# Altium project PROC054D_MMW_CAS_RF_EVM.PrjPcb (part 6 of 9)

## Sheet PROC054D_System_3V3_Supply.SchDoc: System_3V3_Supply
size 558 x 431 mm; Date: Not shown in title block; ApprovedBy: Not shown in title block; CheckedBy: Not shown in title block; Author: Not shown in title block; CompanyName: Not shown in title block; DrawnBy: a0271760; Engineer: Not shown in title block; Organization: Not shown in title block; Address1: Not shown in title block; Address2: Not shown in title block; Address3: Not shown in title block; Address4: Not shown in title block; DocumentNumber: 8; Revision: Use project pAWRameter SCH_Rev; SheetNumber: 8; SheetTotal: 19; PageSetup: Record=PageOptions|CenterHorizontal=True|CenterVertical=True|PrintScale=1.00|XCorrection=1.00|YCorrection=1.00|PrintKind=0|BorderSize=5000000|LeftOffset=0|BottomOffset=0|Orientation=2|PaperLength=1000|PaperWidth=1000|Scale=100|PaperSource=15|PrintQuality=600|MediaType=1|DitherType=10|PaperKind=Letter|PrintScaleMode=1; CurrentTime: Not shown in title block; CurrentDate: Not shown in title block; Time: Not shown in title block; DocumentFullPathAndName: Not shown in title block; DocumentName: Not shown in title block; ModifiedDate: Not shown in title block; ImagePath: Not shown in title block
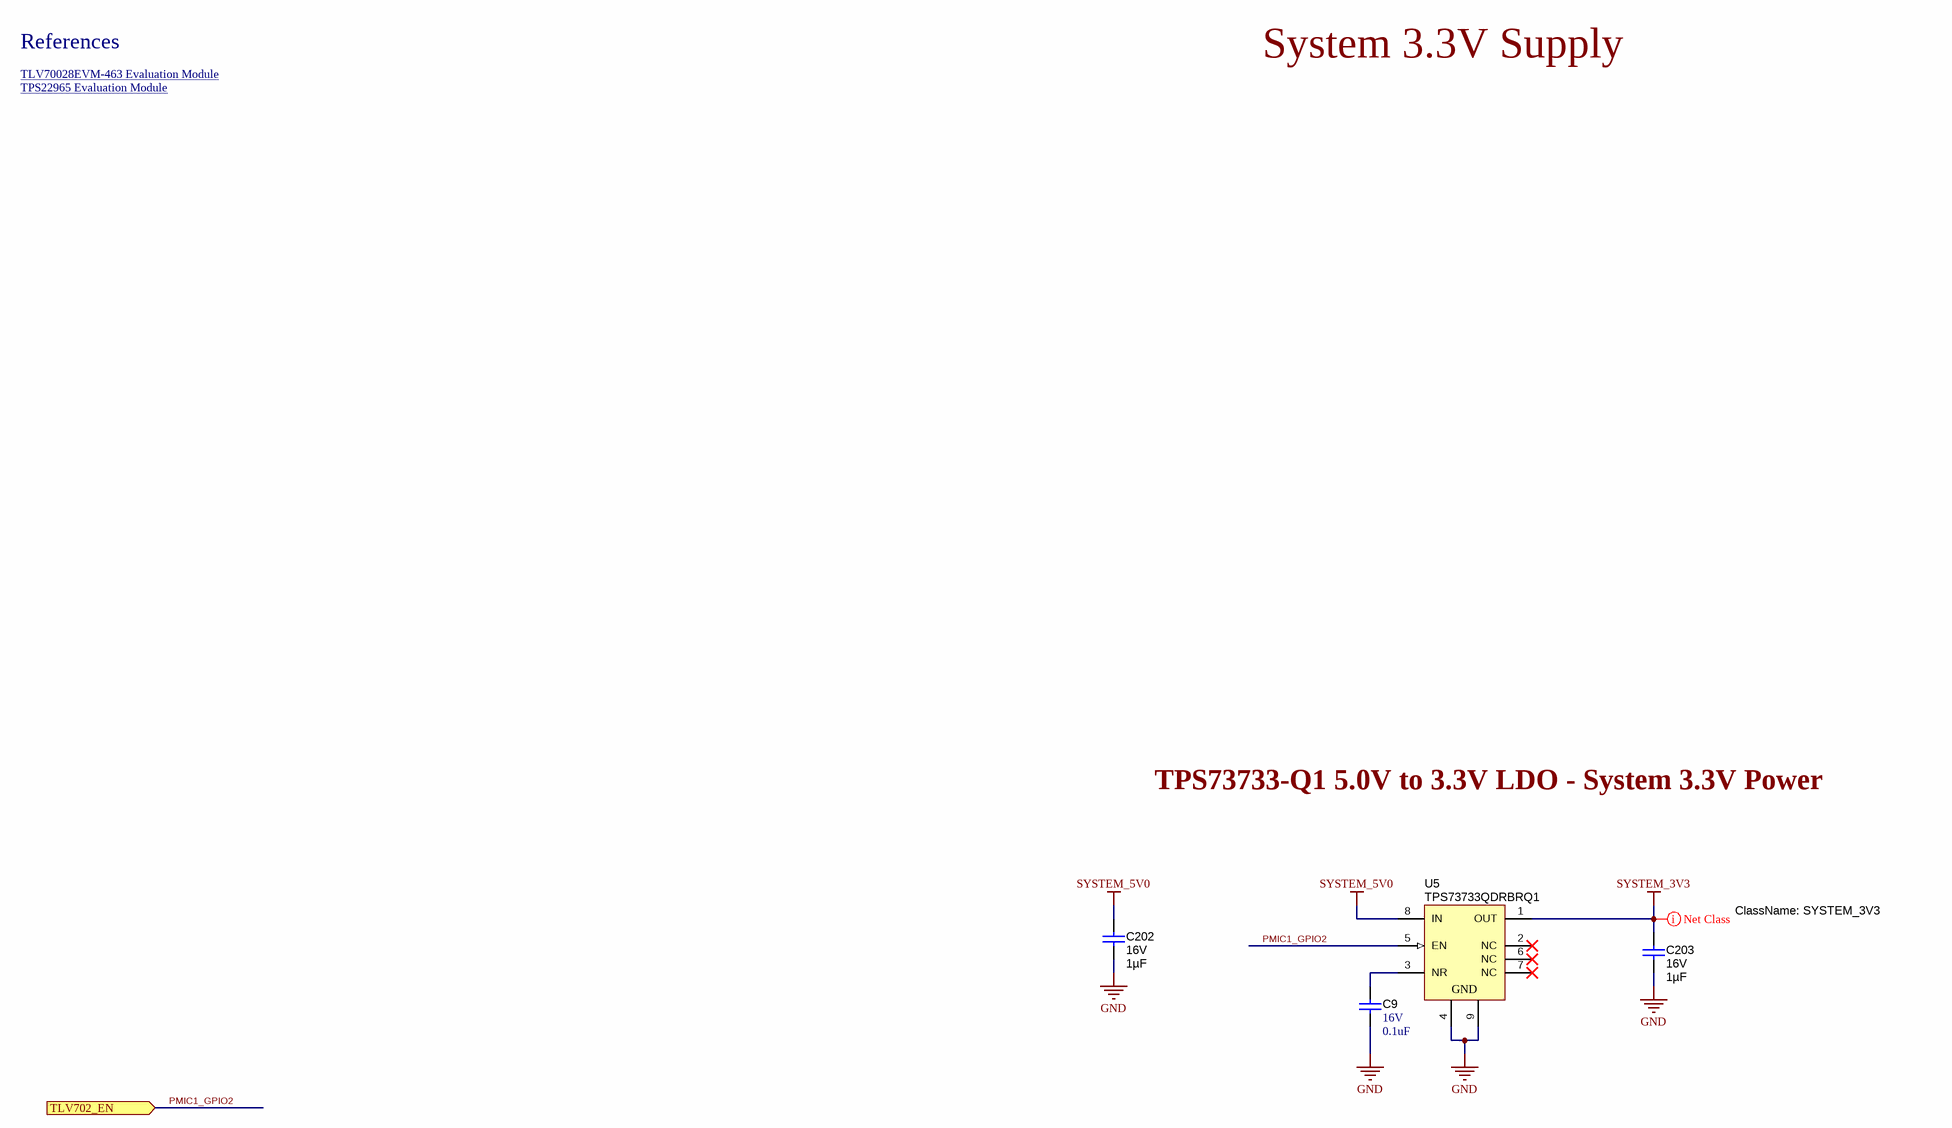
[diagram p27: PROC054D_System_3V3_Supply.SchDoc]

### Parts
C9  VDC_V: 16V  ValueDisplayed: 0.1uF  [0402]  (hidden comment: GCM155R71C104KA55D)
C202  VDC_V: 16V  ValueDisplayed: 1µF  [0603]  (hidden comment: GCM188R71C105KA64J)
C203  VDC_V: 16V  ValueDisplayed: 1µF  [0603]  (hidden comment: GCM188R71C105KA64J)
U5  TPS73733QDRBRQ1  [DRB0008A]

### Ports
TLV702_EN (in)

### Nets
GND: C9.2 C202.2 C203.2 U5.4(GND) U5.9(GND)
SYSTEM_3V3: C203.1 U5.1(OUT)
SYSTEM_5V0: C202.1 U5.8(IN)
PMIC1_GPIO2: U5.5(EN) ; port TLV702_EN
NetC9_1: C9.1 U5.3(NR)

Not connected (* = marked no-connect by the designer): U5 2(NC)* 6(NC)* 7(NC)*

### Layout directives
net class SYSTEM_3V3: SYSTEM_3V3

### Notes on the sheet
- References
- System 3.3V Supply
- TLV70028EVM-463 Evaluation Module <http://www.ti.com/tool/tlv70028evm-463>
- TPS22965 Evaluation Module <http://www.ti.com/tool/tps22965evm-023>
- TPS73733-Q1 5.0V to 3.3V LDO - System 3.3V Power
- Drawn By:
- SVN Rev:
- Number:
- TID #:
- Orderable:
- Rev:
- Sheet Title:
- File:
- Project Title:
- Designed for:
- Assembly VAWRiant:
- Mod. Date:
- Sheet:
- Size:
- of
- C
- http://www.ti.com
- Texas Instruments and/or its licensors do not wAWRrant the accuracy or completeness of this specification or any information contained therein. Texas Instruments and/or its licensors do not wAWRrant that this design will meet the specifications, will be suitable for your application or fit for any pAWRticulAWR purpose, or will operate in an implementation. Texas Instruments and/or its licensors do not wAWRrant that the design is production worthy. You should completely validate and test your design implementation to confirm the system functionality for your application.
- Engineer:
- Contact:
- © Texas Instruments

### Library data of the parts
C9 = CMP-0006351-2: as C162 on sheet PROC054D_System_Power; Publisher: Texas Instruments; TempCo: X7R; Published: 2008-06-19; RoHS: Y; MountType: SMT; Supplier 1: Digi-Key; PackageReference: 0402; Tolerance_%: 10%; Cap_Case: 0402; Value2: 16V; SizeArea_mm2: 0.5; CompType: Capacitor; LatestRevisionDate: 2017-03-09; PartNumber: GCM155R71C104KA55D; AEC Qualified: ?; ComponentLink1Description: Datasheet link; Supplier Part Number 1: 490-4759-2-ND; Technology: Ceramic; ComponentLink1URL: http://psearch.murata.com/capacitor/product/GCM155R71C104KA55%23.pdf
C202 C203 = CMP-0079154-1: CAP, CERM, 1 µF, 16 V,+/- 10%, X7R, AEC-Q200 Grade 1, 0603; Manufacturer: MuRata; SizeAreaWB_mm2: 4.68; SizeArea_mm2: 1.28; AEC Qualified: Y; AEC Category: Q200; Value: 1uF; TaMax_C: 125°C; SizeZ_mm: 1; Polarized: N; TaMin_C: -55°C; SizeY_mm: 0.8; U/M: EA; SizeX_mm: 1.6; ComponentLink1Description: Datasheet link; Cap_F: 1µF; RoHS: Y; Tolerance_%: 10%; Supplier 1: Digi-Key; PackageReference: 0603; Technology: Ceramic; PartNumber: GCM188R71C105KA64J; TempCo: X7R; Supplier Part Number 2: 81-GCM188R71C105KA4J; Supplier 2: Mouser; AEC Grade: 1; Value2: 16V; ComponentLink1URL: https://www.murata.com/~/media/webrenewal/support/library/catalog/products/capacitor/mlcc/c03e.ashx; CompType: Capacitor; MountType: SMT; Supplier Part Number 1: 490-12657-1-ND; Cap_Case: 0603
U5 = CMP-0036354-2: Single Output Automotive LDO, 1 A, Fixed 3.3 V Output, 2.2 to 5.5 V Input, with Reverse Current Protection, 8-pin SON (DRB), -40 to 125 degC, Green (RoHS & no Sb/Br); Manufacturer: Texas Instruments; Vin(Min)(V): 2.2; Vout Adj(Max)(V): 3.3; Vin(Max)(V): 5.5; Accuracy(%): 3; SubFamily: Single Channel LDO; Iq(Typ)(mA): 0.3; Vdo(Typ)(mV): 130; Iout(Max)(A): 1; ComponentLink1URL: http://www.ti.com/; Fixed Output Options(V): 3.3; PackageDescription: 8-Pin Plastic Small Outline, Body 3 x 3 mm, Pitch 0.65 mm; ComponentLink2URL: http://www.ti.com/general/docs/lit/getliterature.tsp?genericPartNumber=TPS73733-Q1&fileType=pdf; ComponentLink3Description: Package Specification; Eco-Plan: Green (RoHS & no Sb/Br); ComponentLink2Description: Datasheet; Vout Adj(Min)(V): 3.3; Rating: Automotive; ComponentLink3URL: http://www.ti.com/litv/pdf/mpds118h; PackageReference: DRB0008A; DatasheetVersion: SBVS123; PartNumber: TPS73733QDRBRQ1; PackageVersion: 4203482-2/K; Mounting Technology: Surface Mount; ComponentLink1Description: Manufacturer URL

## Sheet PROC054D_AWR_2_AWR_3_LP87524P.SchDoc: AWR_2_AWR_3_LP87524P
size 558 x 431 mm; Date: Not shown in title block; ApprovedBy: Not shown in title block; CheckedBy: Not shown in title block; Author: Not shown in title block; CompanyName: Not shown in title block; DrawnBy: a0271760; Engineer: Not shown in title block; Organization: Not shown in title block; Address1: Not shown in title block; Address2: Not shown in title block; Address3: Not shown in title block; Address4: Not shown in title block; DocumentNumber: 5; Revision: Use project pAWRameter SCH_Rev; SheetNumber: 5; SheetTotal: 19; PageSetup: Record=PageOptions|CenterHorizontal=True|CenterVertical=True|PrintScale=1.00|XCorrection=1.00|YCorrection=1.00|PrintKind=0|BorderSize=5000000|LeftOffset=0|BottomOffset=0|Orientation=2|PaperLength=1000|PaperWidth=1000|Scale=100|PaperSource=15|PrintQuality=600|MediaType=1|DitherType=10|PaperKind=Letter|PrintScaleMode=1; CurrentTime: Not shown in title block; CurrentDate: Not shown in title block; Time: Not shown in title block; DocumentFullPathAndName: Not shown in title block; DocumentName: Not shown in title block; ModifiedDate: Not shown in title block; ImagePath: Not shown in title block
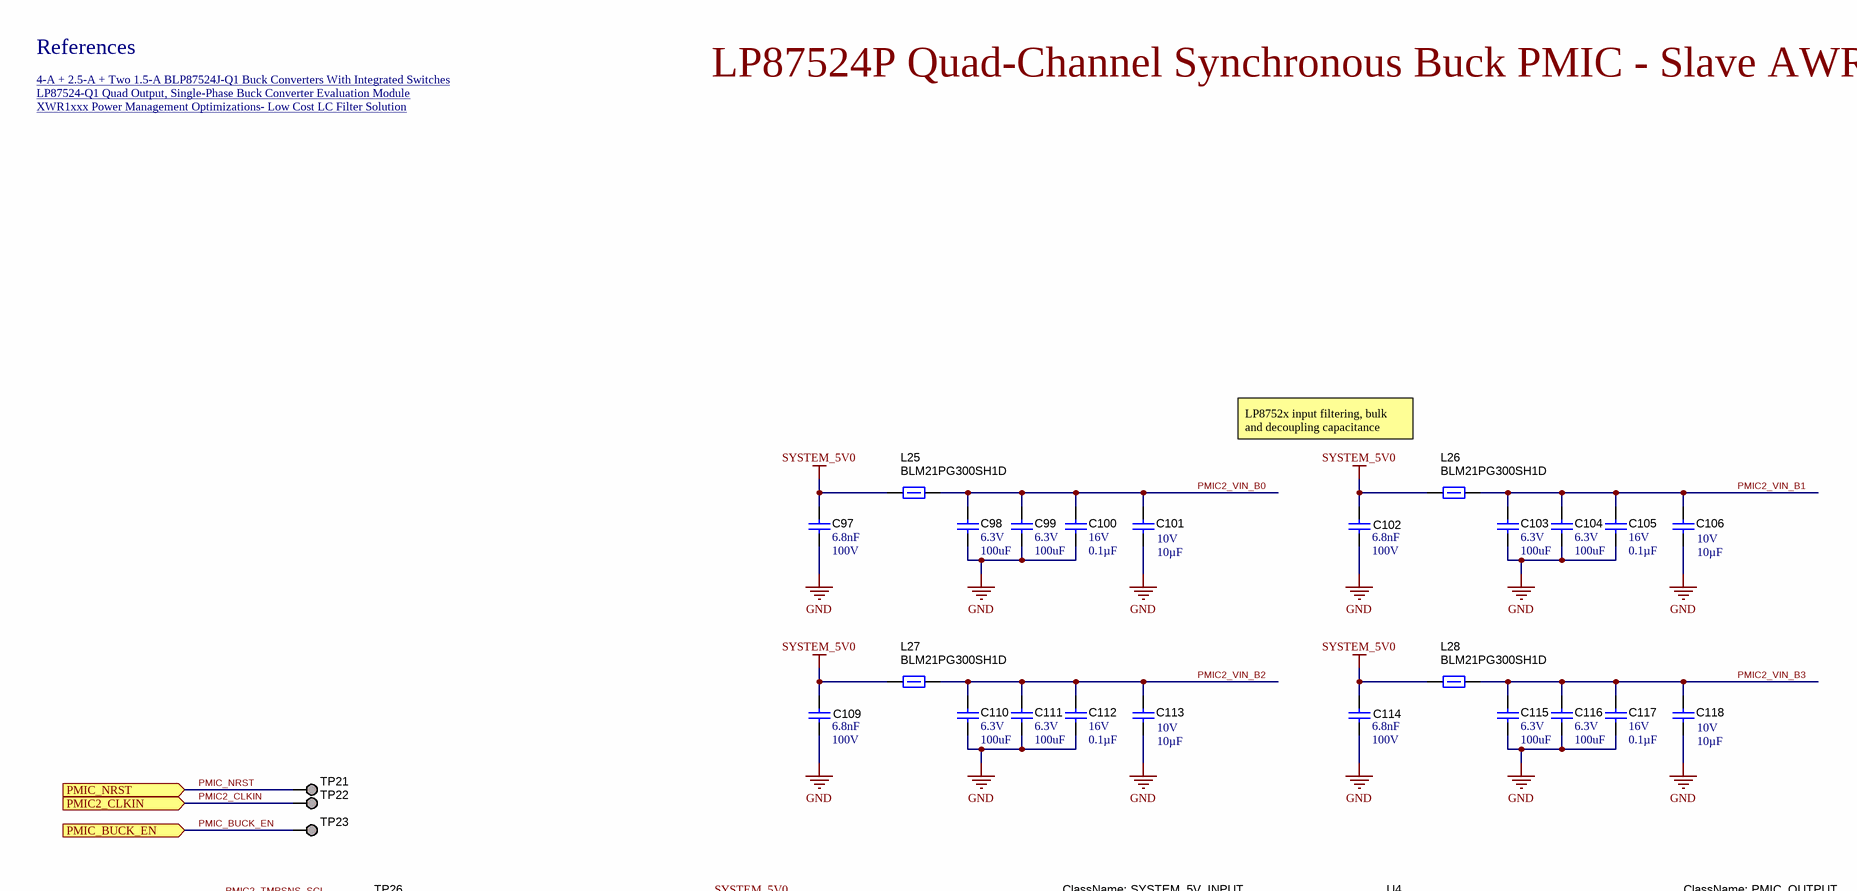
[diagram p28: PROC054D_AWR_2_AWR_3_LP87524P.SchDoc, top left]
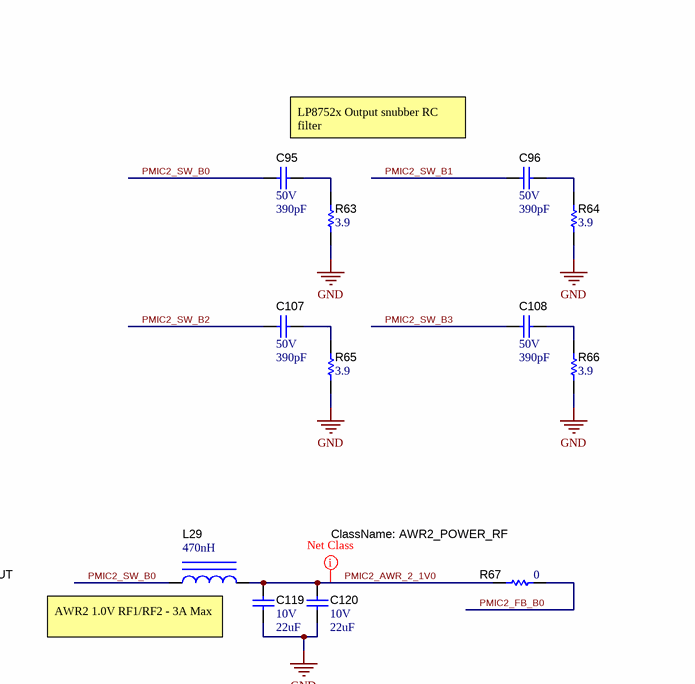
[diagram p29: PROC054D_AWR_2_AWR_3_LP87524P.SchDoc, top right]
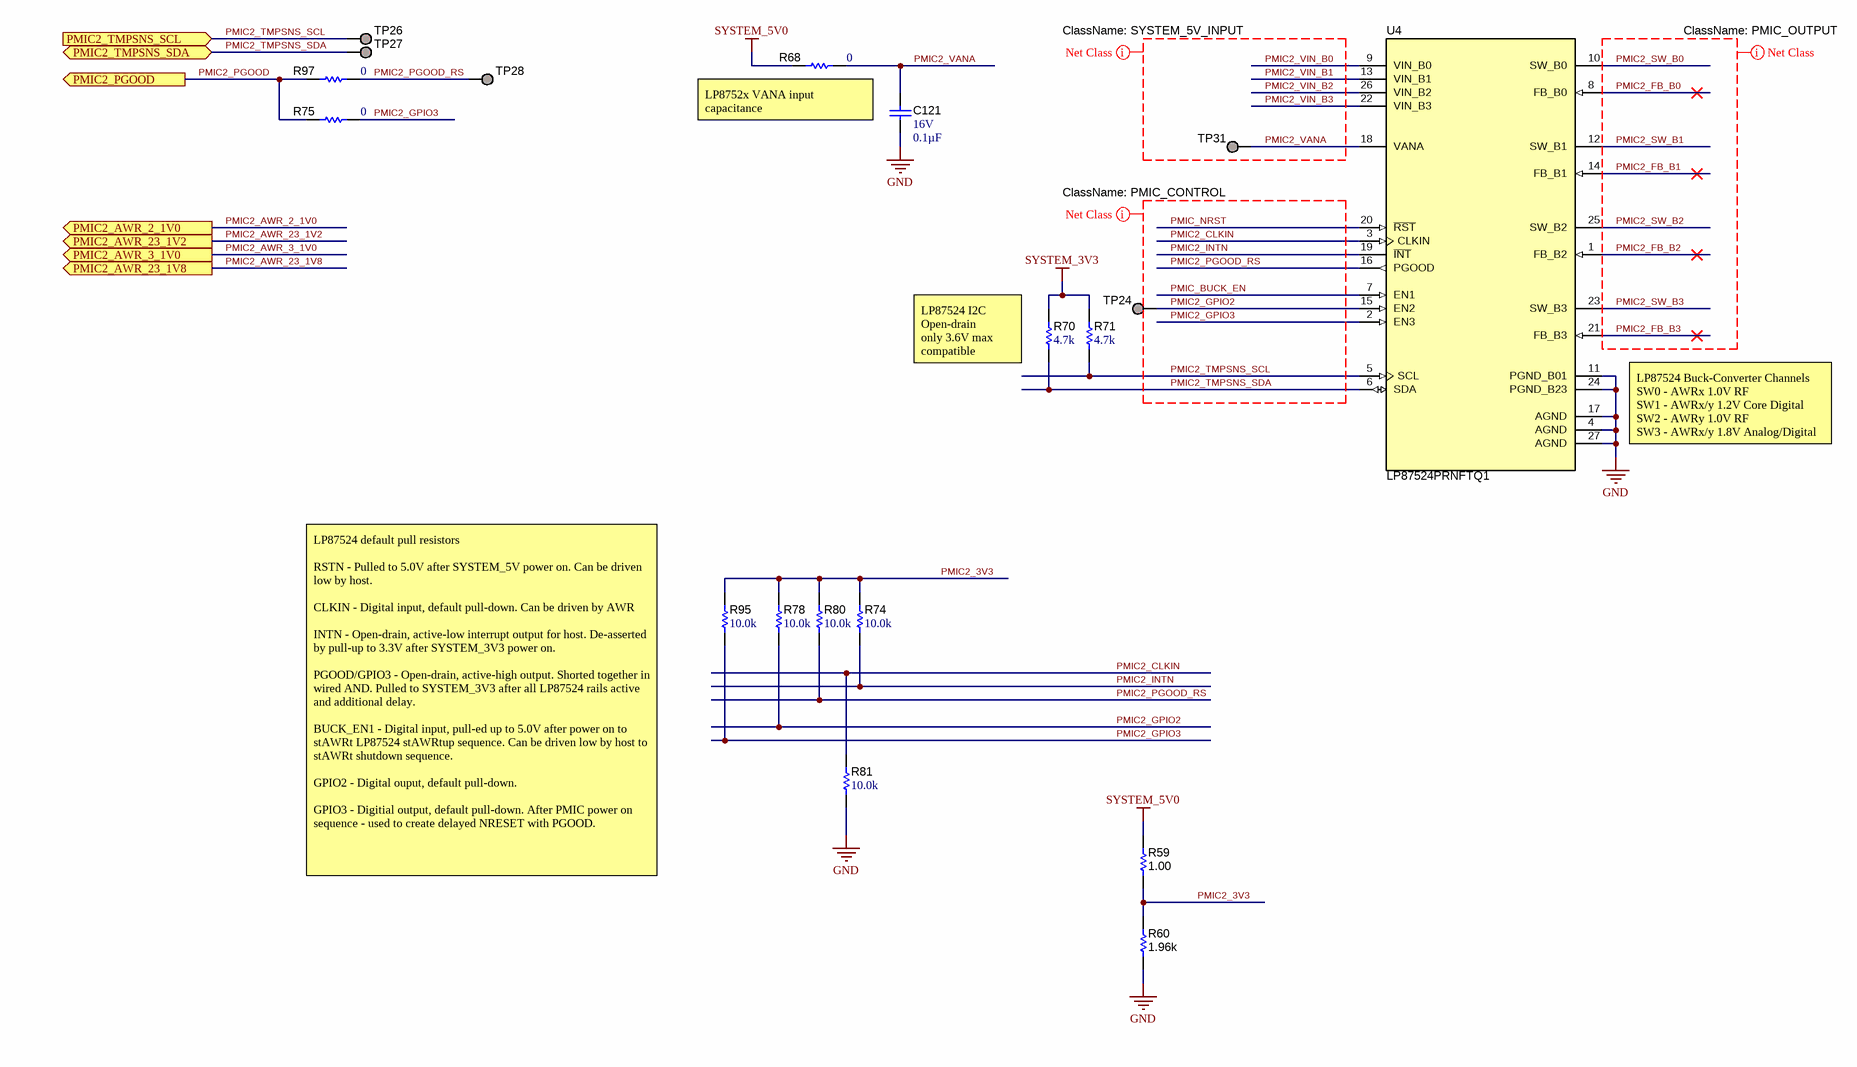
[diagram p30: PROC054D_AWR_2_AWR_3_LP87524P.SchDoc, bottom left]
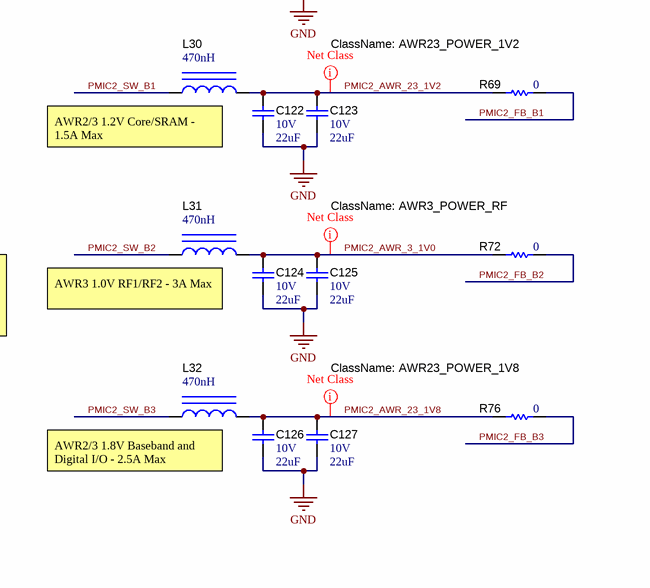
[diagram p31: PROC054D_AWR_2_AWR_3_LP87524P.SchDoc, bottom right]

### Parts
C95  VDC_V: 50V  ValueDisplayed: 390pF  [0402S]  (hidden comment: GCM155R71H391KA37D)
C96  VDC_V: 50V  ValueDisplayed: 390pF  [0402S]  (hidden comment: GCM155R71H391KA37D)
C97  Cap_F: 6.8nF  VDC_V: 100V  [0603S]  (hidden comment: GCM188R72A682KA37D)
C98  VDC_V: 6.3V  ValueDisplayed: 100uF  [0805L]  (hidden comment: GRM21BR60J107M)
C99  VDC_V: 6.3V  ValueDisplayed: 100uF  [0805L]  (hidden comment: GRM21BR60J107M)
C100  VDC_V: 16V  ValueDisplayed: 0.1µF  [0402S]  (hidden comment: GCM155R71C104JA55D)
C101  Cap_F: 10µF  VDC_V: 10V  [0805L]  (hidden comment: GRM21BR71A106KA73L)
C102  Cap_F: 6.8nF  VDC_V: 100V  [0603S]  (hidden comment: GCM188R72A682KA37D)
C103  VDC_V: 6.3V  ValueDisplayed: 100uF  [0805L]  (hidden comment: GRM21BR60J107M)
C104  VDC_V: 6.3V  ValueDisplayed: 100uF  [0805L]  (hidden comment: GRM21BR60J107M)
C105  VDC_V: 16V  ValueDisplayed: 0.1µF  [0402S]  (hidden comment: GCM155R71C104JA55D)
C106  Cap_F: 10µF  VDC_V: 10V  [0805L]  (hidden comment: GRM21BR71A106KA73L)
C107  VDC_V: 50V  ValueDisplayed: 390pF  [0402S]  (hidden comment: GCM155R71H391KA37D)
C108  VDC_V: 50V  ValueDisplayed: 390pF  [0402S]  (hidden comment: GCM155R71H391KA37D)
C109  Cap_F: 6.8nF  VDC_V: 100V  [0603S]  (hidden comment: GCM188R72A682KA37D)
C110  VDC_V: 6.3V  ValueDisplayed: 100uF  [0805L]  (hidden comment: GRM21BR60J107M)
C111  VDC_V: 6.3V  ValueDisplayed: 100uF  [0805L]  (hidden comment: GRM21BR60J107M)
C112  VDC_V: 16V  ValueDisplayed: 0.1µF  [0402S]  (hidden comment: GCM155R71C104JA55D)
C113  Cap_F: 10µF  VDC_V: 10V  [0805L]  (hidden comment: GRM21BR71A106KA73L)
C114  Cap_F: 6.8nF  VDC_V: 100V  [0603S]  (hidden comment: GCM188R72A682KA37D)
C115  VDC_V: 6.3V  ValueDisplayed: 100uF  [0805L]  (hidden comment: GRM21BR60J107M)
C116  VDC_V: 6.3V  ValueDisplayed: 100uF  [0805L]  (hidden comment: GRM21BR60J107M)
C117  VDC_V: 16V  ValueDisplayed: 0.1µF  [0402S]  (hidden comment: GCM155R71C104JA55D)
C118  Cap_F: 10µF  VDC_V: 10V  [0805L]  (hidden comment: GRM21BR71A106KA73L)
C119  VDC_V: 10V  ValueDisplayed: 22uF  [0805L]  (hidden comment: C2012X7S1A226M125AC)
C120  VDC_V: 10V  ValueDisplayed: 22uF  [0805L]  (hidden comment: C2012X7S1A226M125AC)
C121  VDC_V: 16V  ValueDisplayed: 0.1µF  [0402S]  (hidden comment: GCM155R71C104JA55D)
C122  VDC_V: 10V  ValueDisplayed: 22uF  [0805L]  (hidden comment: C2012X7S1A226M125AC)
C123  VDC_V: 10V  ValueDisplayed: 22uF  [0805L]  (hidden comment: C2012X7S1A226M125AC)
C124  VDC_V: 10V  ValueDisplayed: 22uF  [0805L]  (hidden comment: C2012X7S1A226M125AC)
C125  VDC_V: 10V  ValueDisplayed: 22uF  [0805L]  (hidden comment: C2012X7S1A226M125AC)
C126  VDC_V: 10V  ValueDisplayed: 22uF  [0805L]  (hidden comment: C2012X7S1A226M125AC)
C127  VDC_V: 10V  ValueDisplayed: 22uF  [0805L]  (hidden comment: C2012X7S1A226M125AC)
L25  BLM21PG300SH1D  [0805_HV]
L26  BLM21PG300SH1D  [0805_HV]
L27  BLM21PG300SH1D  [0805_HV]
L28  BLM21PG300SH1D  [0805_HV]
L29  ValueDisplayed: 470nH  [DFE252012P]  (hidden comment: DFE252012PD-R47M)
L30  ValueDisplayed: 470nH  [DFE252012P]  (hidden comment: DFE252012PD-R47M)
L31  ValueDisplayed: 470nH  [DFE252012P]  (hidden comment: DFE252012PD-R47M)
L32  ValueDisplayed: 470nH  [DFE252012P]  (hidden comment: DFE252012PD-R47M)
R59  ValueDisplayed: 1.00  [0603]  (hidden comment: CRCW06031R00FKEA)
R60  ValueDisplayed: 1.96k  [0603]  (hidden comment: CRCW06031K96FKEA)
R63  ValueDisplayed: 3.9  [0402S]  (hidden comment: CRCW04023R90JNED)
R64  ValueDisplayed: 3.9  [0402S]  (hidden comment: CRCW04023R90JNED)
R65  ValueDisplayed: 3.9  [0402S]  (hidden comment: CRCW04023R90JNED)
R66  ValueDisplayed: 3.9  [0402S]  (hidden comment: CRCW04023R90JNED)
R67  ValueDisplayed: 0  [0402S]  (hidden comment: CRCW04020000Z0ED)
R68  ValueDisplayed: 0  [0603S]  (hidden comment: MCT06030Z0000ZP500)
R69  ValueDisplayed: 0  [0402S]  (hidden comment: CRCW04020000Z0ED)
R70  ValueDisplayed: 4.7k  [0402]  (hidden comment: CRCW04024K70JNED)
R71  ValueDisplayed: 4.7k  [0402]  (hidden comment: CRCW04024K70JNED)
R72  ValueDisplayed: 0  [0402S]  (hidden comment: CRCW04020000Z0ED)
R74  ValueDisplayed: 10.0k  [0402]  (hidden comment: CRCW040210K0FKED)
R75  ValueDisplayed: 0  [0603]  (hidden comment: MCT06030Z0000ZP500)
R76  ValueDisplayed: 0  [0402S]  (hidden comment: CRCW04020000Z0ED)
R78  ValueDisplayed: 10.0k  [0402S]  (hidden comment: CRCW040210K0FKED)
R80  ValueDisplayed: 10.0k  [0402]  (hidden comment: CRCW040210K0FKED)
R81  ValueDisplayed: 10.0k  [0402]  (hidden comment: CRCW040210K0FKED)
R95  ValueDisplayed: 10.0k  [0402]  (hidden comment: CRCW040210K0FKED)
R97  ValueDisplayed: 0  [0603]  (hidden comment: MCT06030Z0000ZP500)
TP21  TP_SM_1MM  [TP_SM_1MM]  (value not drawn)  (no BOM)
TP22  TP_SM_1MM  [TP_SM_1MM]  (value not drawn)  (no BOM)
TP23  TP_SM_1MM  [TP_SM_1MM]  (value not drawn)  (no BOM)
TP24  TP_SM_1MM  [TP_SM_1MM]  (value not drawn)  (no BOM)
TP26  TP_SM_1MM  [TP_SM_1MM]  (value not drawn)  (no BOM)
TP27  TP_SM_1MM  [TP_SM_1MM]  (value not drawn)  (no BOM)
TP28  TP_SM_1MM  [TP_SM_1MM]  (value not drawn)  (no BOM)
TP31  TP_SM_1MM  [TP_SM_1MM]  (value not drawn)  (no BOM)
U4  LP87524PRNFTQ1  [RNF0026C]

### Ports
PMIC2_AWR_2_1V0 (out), PMIC2_AWR_3_1V0 (out), PMIC2_AWR_23_1V2 (out), PMIC2_AWR_23_1V8 (out), PMIC2_CLKIN (in), PMIC2_PGOOD (out), PMIC2_TMPSNS_SCL (in), PMIC2_TMPSNS_SDA (bidir), PMIC_BUCK_EN (in), PMIC_NRST (in)

### Nets
GND: C97.2 C98.2 C99.2 C100.2 C101.2 C102.2 C103.2 C104.2 C105.2 C106.2 C109.2 C110.2 C111.2 C112.2 C113.2 C114.2 C115.2 C116.2 C117.2 C118.2 C119.2 C120.2 C121.2 C122.2 C123.2 C124.2 C125.2 C126.2 C127.2 R60.1 R63.1 R64.1 R65.1 R66.1 R81.1 U4.4(AGND) U4.11(PGND_B01) U4.17(AGND) U4.24(PGND_B23) U4.27(AGND)
SYSTEM_3V3: R70.1 R71.2
SYSTEM_5V0: C97.1 C102.1 C109.1 C114.1 L25.1 L26.1 L27.1 L28.1 R59.2 R68.1
PMIC2_3V3: R59.1 R60.2 R74.2 R78.2 R80.2 R95.2
PMIC2_AWR_2_1V0: C119.1 C120.1 L29.2 R67.1 ; port PMIC2_AWR_2_1V0
PMIC2_AWR_3_1V0: C124.1 C125.1 L31.2 R72.1 ; port PMIC2_AWR_3_1V0
PMIC2_AWR_23_1V2: C122.1 C123.1 L30.2 R69.1 ; port PMIC2_AWR_23_1V2
PMIC2_AWR_23_1V8: C126.1 C127.1 L32.2 R76.1 ; port PMIC2_AWR_23_1V8
PMIC2_CLKIN: R81.2 TP22.1 U4.3(CLKIN) ; port PMIC2_CLKIN
PMIC2_FB_B0: R67.2 U4.8(FB_B0)
PMIC2_FB_B1: R69.2 U4.14(FB_B1)
PMIC2_FB_B2: R72.2 U4.1(FB_B2)
PMIC2_FB_B3: R76.2 U4.21(FB_B3)
PMIC2_GPIO2: R78.1 TP24.1 U4.15(EN2)
PMIC2_GPIO3: R75.2 R95.1 U4.2(EN3)
PMIC2_INTN: R74.1 U4.19(~{INT})
PMIC2_PGOOD: R75.1 R97.1 ; port PMIC2_PGOOD
PMIC2_PGOOD_RS: R80.1 R97.2 TP28.1 U4.16(PGOOD)
PMIC2_SW_B0: C95.1 L29.1 U4.10(SW_B0)
PMIC2_SW_B1: C96.1 L30.1 U4.12(SW_B1)
PMIC2_SW_B2: C107.1 L31.1 U4.25(SW_B2)
PMIC2_SW_B3: C108.1 L32.1 U4.23(SW_B3)
PMIC2_TMPSNS_SCL: R71.1 TP26.1 U4.5(SCL) ; port PMIC2_TMPSNS_SCL
PMIC2_TMPSNS_SDA: R70.2 TP27.1 U4.6(SDA) ; port PMIC2_TMPSNS_SDA
PMIC2_VANA: C121.1 R68.2 TP31.1 U4.18(VANA)
PMIC2_VIN_B0: C98.1 C99.1 C100.1 C101.1 L25.2 U4.9(VIN_B0)
PMIC2_VIN_B1: C103.1 C104.1 C105.1 C106.1 L26.2 U4.13(VIN_B1)
PMIC2_VIN_B2: C110.1 C111.1 C112.1 C113.1 L27.2 U4.26(VIN_B2)
PMIC2_VIN_B3: C115.1 C116.1 C117.1 C118.1 L28.2 U4.22(VIN_B3)
PMIC_BUCK_EN: TP23.1 U4.7(EN1) ; port PMIC_BUCK_EN
PMIC_NRST: TP21.1 U4.20(~{RST}) ; port PMIC_NRST
NetC95_2: C95.2 R63.2
NetC96_2: C96.2 R64.2
NetC107_2: C107.2 R65.2
NetC108_2: C108.2 R66.2

### Layout directives
net class SYSTEM_5V_INPUT: PMIC2_VANA, PMIC2_VIN_B0, PMIC2_VIN_B1, PMIC2_VIN_B2, PMIC2_VIN_B3
net class PMIC_CONTROL: PMIC2_CLKIN, PMIC2_GPIO2, PMIC2_GPIO3, PMIC2_INTN, PMIC2_PGOOD_RS, PMIC2_TMPSNS_SCL, PMIC2_TMPSNS_SDA, PMIC_BUCK_EN, PMIC_NRST
net class PMIC_OUTPUT: PMIC2_FB_B0, PMIC2_FB_B1, PMIC2_FB_B2, PMIC2_FB_B3, PMIC2_SW_B0, PMIC2_SW_B1, PMIC2_SW_B2, PMIC2_SW_B3
net class AWR23_POWER_1V2: PMIC2_AWR_23_1V2
net class AWR23_POWER_1V8: PMIC2_AWR_23_1V8
net class AWR2_POWER_RF: PMIC2_AWR_2_1V0
net class AWR3_POWER_RF: PMIC2_AWR_3_1V0

### Notes on the sheet
- References
- LP87524-Q1 Quad Output, Single-Phase Buck Converter Evaluation Module <http://www.ti.com/tool/lp87524q1evm>
- 4-A + 2.5-A + Two 1.5-A BLP87524J-Q1 Buck Converters With Integrated Switches <http://www.ti.com/product/lp87524j-q1>
- XWR1xxx Power Management Optimizations- Low Cost LC Filter Solution <http://www.ti.com/lit/pdf/swra577>
- LP87524P Quad-Channel Synchronous Buck PMIC - Slave AWR_2 and Slave AWR_3
- LP8752x input filtering, bulk and decoupling capacitance
- (near C95) LP8752x Output snubber RC filter
- (near L29) AWR2 1.0V RF1/RF2 - 3A Max
- (near R68) LP8752x VANA input capacitance
- (near L30) AWR2/3 1.2V Core/SRAM - 1.5A Max
- (near R70) LP87524 I2C
  Open-drain
  only 3.6V max compatible
- (near L31) AWR3 1.0V RF1/RF2 - 3A Max
- LP87524 Buck-Converter Channels
  SW0 - AWRx 1.0V RF
  SW1 - AWRx/y 1.2V Core Digital
  SW2 - AWRy 1.0V RF
  SW3 - AWRx/y 1.8V Analog/Digital
- (near L32) AWR2/3 1.8V Baseband and Digital I/O - 2.5A Max
- LP87524 default pull resistors
  RSTN - Pulled to 5.0V after SYSTEM_5V power on. Can be driven low by host.
  CLKIN - Digital input, default pull-down. Can be driven by AWR
  INTN - Open-drain, active-low interrupt output for host. De-asserted by pull-up to 3.3V after SYSTEM_3V3 power on.
  PGOOD/GPIO3 - Open-drain, active-high output. Shorted together in wired AND. Pulled to SYSTEM_3V3 after all LP87524 rails active and additional delay.
  BUCK_EN1 - Digital input, pull-ed up to 5.0V after power on to stAWRt LP87524 stAWRtup sequence. Can be driven low by host to stAWRt shutdown sequence.
  GPIO2 - Digital ouput, default pull-down.
  GPIO3 - Digitial output, default pull-down. After PMIC power on sequence - used to create delayed NRESET with PGOOD.
- Drawn By:
- SVN Rev:
- Number:
- TID #:
- Orderable:
- Rev:
- Sheet Title:
- File:
- Project Title:
- Designed for:
- Assembly VAWRiant:
- Mod. Date:
- Sheet:
- Size:
- of
- C
- http://www.ti.com
- Texas Instruments and/or its licensors do not wAWRrant the accuracy or completeness of this specification or any information contained therein. Texas Instruments and/or its licensors do not wAWRrant that this design will meet the specifications, will be suitable for your application or fit for any pAWRticulAWR purpose, or will operate in an implementation. Texas Instruments and/or its licensors do not wAWRrant that the design is production worthy. You should completely validate and test your design implementation to confirm the system functionality for your application.
- Engineer:
- Contact:
- © Texas Instruments

### Library data of the parts
C95 C96 C107 C108 = CMP-0080703-2: as C37 on sheet PROC054D_AWR_1_AWR_4_LP87524P; CompType: Capacitor; MountType: SMT; Supplier Part Number 1: 81-GCM155R71H391KA7D; PackageReference: 0402; RoHS: Y; ComponentLink1URL: https://search.murata.co.jp/Ceramy/image/img/A01X/G101/ENG/GCM155R71H391KA37-01.pdf; Tolerance_%: 10%; Supplier 1: Mouser; AEC Grade: 1; Value2: 50V; PartNumber: GCM155R71H391KA37D; Cap_F: 390pF; TempCo: X7R; Technology: Ceramic; ComponentLink1Description: Datasheet link; SizeArea_mm2: 0.5
C97 C102 C109 C114 = CMP-0860888-1: as C39 on sheet PROC054D_AWR_1_AWR_4_LP87524P; Tolerance_%: 10%; RoHS: Y; ComponentLink1URL: https://www.murata.com/~/media/webrenewal/support/library/catalog/products/capacitor/mlcc/c03e.ashx?la=en-us; SizeZ_mm: 1; PackageReference: 0603; TempCo: X7R; CompType: Capacitor; Value2: 100V; PartNumber: GCM188R72A682KA37D; MountType: SMT; Technology: Ceramic; ComponentLink1Description: Datasheet link
C98 C99 C103 C104 C110 C111 C115 C116 = CMP-0008280-2: as C45 on sheet PROC054D_AWR_1_AWR_4_LP87524P; Publisher: Texas Instruments; TempCo: X5R; Published: 2008-06-19; MountType: SMT; PackageReference: 0805; Tolerance_%: 20%; Value2: 6.3V; CompType: Capacitor; LatestRevisionDate: 2017-03-09; PartNumber: GRM21BR60J107M; AEC Qualified: ?; ComponentLink1Description: Datasheet link; Technology: Ceramic; ComponentLink1URL: https://sps06.itg.ti.com/sites/KMS/crossdivteams/altium/docs/ComponentDatasheets/100uF_6p3V_0805_GRM21BR60J107M.pdf
C100 C105 C112 C117 C121 = CMP-0080702-1: as C47 on sheet PROC054D_AWR_1_AWR_4_LP87524P; ComponentLink1Description: Datasheet link; RoHS: Y; Tolerance_%: 5%; Supplier 1: Digi-Key; PackageReference: 0402; Technology: Ceramic; PartNumber: GCM155R71C104JA55D; TempCo: X7R; Supplier Part Number 2: 81-GCM155R71C104JA5D; Supplier 2: Mouser; SizeY_mm: 0.5; Value2: 16V; ComponentLink1URL: https://search.murata.co.jp/Ceramy/image/img/A01X/G101/ENG/GCM155R71C104JA55-01.pdf; CompType: Capacitor; MountType: SMT; Supplier Part Number 1: 490-16433-1-ND; SizeX_mm: 1
C101 C106 C113 C118 = CMP-0081849-1: as C43 on sheet PROC054D_AWR_1_AWR_4_LP87524P; ComponentLink1URL: https://search.murata.co.jp/Ceramy/image/img/A01X/G101/ENG/GRM21BR71A106KA73-01.pdf; Supplier Part Number 2: 81-GRM21BR71A106KA3L; Supplier 2: Mouser; TempCo: X7R; RoHS: Y; MountType: SMT; Green_EU RoHS-2: Incomplete; Supplier 1: Digi-Key; Green_EU RoHS: Passed; PackageReference: 0805; Tolerance_%: 10%; CompType: Capacitor; PartNumber: GRM21BR71A106KA73L; AEC Qualified: N; ComponentLink1Description: Datasheet link; AEC Grade: N/A; Supplier Part Number 1: 490-10516-2-ND; Technology: Ceramic; ValueDisplayed: 10µF
C119 C120 C122-C127 = CMP-0007890-1: as C61 on sheet PROC054D_AWR_1_AWR_4_LP87524P; ComponentLink1URL: https://product.tdk.com/en/search/capacitor/ceramic/mlcc/info?part_no=C2012X7S1A226M125AC; Supplier Part Number 2: 05X9251; Publisher: Texas Instruments; Supplier 2: Newark; TempCo: X7S; Published: 2008-06-19; RoHS: Y; MountType: SMT; Supplier 1: Digi-Key; PackageReference: 0805; Tolerance_%: 20%; Value2: 10V; CompType: Capacitor; LatestRevisionDate: 2017-03-09; PartNumber: C2012X7S1A226M125AC; AEC Qualified: N; ComponentLink1Description: Datasheet link; AEC Grade: N/A; Supplier Part Number 1: 445-14560-1-ND; Technology: Ceramic
L25-L28 = CMP-0003364-1: as L9 on sheet PROC054D_AWR_1_AWR_4_LP87524P; ComponentLink1URL: http://www.murata.com/en-us/api/pdfdownloadapi?cate=luNoiseSupprFilteChipFerriBead&partno=BLM21PG300SH1%23; Supplier Part Number 2: 87X8590; Publisher: Texas Instruments; Supplier 2: Newark; Supplier Part Number 3: 81-BLM21PG300SH1D; Supplier 3: Mouser; Published: 2014-04-30; RoHS: Y; MountType: SMT; Supplier 1: Digi-Key; PackageReference: 0805; Value2: 4A; CompType: Ferrite Bead; LatestRevisionDate: 2017-03-09; PartNumber: BLM21PG300SH1D; ComponentLink1Description: Datasheet link; Supplier Part Number 1: 490-11049-1-ND; ValueDisplayed: 30 ohm
L29-L32 = CMP-0058944-1: as L13 on sheet PROC054D_AWR_1_AWR_4_LP87524P; ComponentLink1URL: https://sps06.itg.ti.com/sites/KMS/crossdivteams/altium/docs/ComponentDatasheets/DFE252012PD_Catalouge_20140701 with AEC-Q200.pdf; Publisher: Texas Instruments; Published: 2008-06-26; RoHS: Y; Value1: 0.021 ohm; Material: ?; MountType: SMT; PackageReference: 1008; Value2: 4.7A; CompType: Inductor; Ind_H: 470nH; LatestRevisionDate: 2017-06-02; PartNumber: DFE252012PD-R47M; AEC Qualified: ?; ComponentLink1Description: Datasheet link; Technology: Shielded
R59 = CMP-0022170-4: as R34 on sheet PROC054D_AWR_1_AWR_4_LP87524P; Supplier Part Number 2: 71-CRCW06031R00FKEA; Supplier 2: Mouser; Supplier Part Number 3: 1616871; Supplier 3: Farnell; RoHS: E; Value1: 1%; MountType: SMT; Supplier 1: Newark; PackageReference: 0603; Tolerance_%: 1%; SizeZ_mm: 1; CompType: Resistor; PartNumber: CRCW06031R00FKEA; ComponentLink1Description: Datasheet link; Supplier Part Number 1: 52K8059; Technology: Thick Film; ComponentLink1URL: http://www.vishay.com/docs/20035/dcrcwe3.pdf
R60 = CMP-0022137-4: as R36 on sheet PROC054D_AWR_1_AWR_4_LP87524P; Supplier Part Number 2: 52K8051; Supplier 2: Newark; Supplier Part Number 3: 71-CRCW0603-1.96K-E3; Supplier 3: Mouser; RoHS: E; Value1: 1%; MountType: SMT; Supplier 1: Digi-Key; PackageReference: 0603; Tolerance_%: 1%; Res_ohm: 1.96k; CompType: Resistor; PartNumber: CRCW06031K96FKEA; ComponentLink1Description: Datasheet link; Supplier Part Number 1: 541-1.96KHCT-ND; Technology: Thick Film; ComponentLink1URL: http://www.vishay.com/docs/20035/dcrcwe3.pdf
R63-R66 = CMP-0026928-3: as R40 on sheet PROC054D_AWR_1_AWR_4_LP87524P; Supplier Part Number 2: 71-CRCW0402J-3.9-E3; Supplier 2: Mouser; Supplier Part Number 3: 1739061; Supplier 3: Farnell; RoHS: E; Value1: 5%; MountType: SMT; Supplier 1: Digi-Key; PackageReference: 0402; Tolerance_%: 5%; Res_ohm: 3.9; SizeArea_mm2: 0.5; CompType: Resistor; PartNumber: CRCW04023R90JNED; ComponentLink1Description: Datasheet link; Supplier Part Number 1: 541-3.9JCT-ND; Technology: Thick Film; ComponentLink1URL: http://www.vishay.com/docs/20035/dcrcwe3.pdf
R67 R69 R72 R76 = CMP-0026822-3: as R43 on sheet PROC054D_AWR_1_AWR_4_LP87524P; Supplier Part Number 2: 52K6543; Supplier 2: Newark; Supplier Part Number 3: 71-CRCW0402-0-E3; Supplier 3: Mouser; RoHS: E; Value1: 5%; MountType: SMT; Supplier 1: Digi-Key; PackageReference: 0402; Tolerance_%: 5%; Res_ohm: 0; SizeArea_mm2: 0.5; CompType: Resistor; PartNumber: CRCW04020000Z0ED; ComponentLink1Description: Datasheet link; Supplier Part Number 1: 541-0.0JCT-ND; Technology: Thick Film; ComponentLink1URL: http://www.vishay.com/docs/20035/dcrcwe3.pdf; AEC Grade: 0
R68 R75 R97 = CMP-0025884-3: as R73 on sheet PROC054D_AWR_1_AWR_4_LP87524P; Supplier Part Number 2: 96Y9454; Publisher: Texas Instruments; Supplier 2: Newark; Supplier Part Number 3: 594-MCT06030Z0000ZP5; Supplier 3: Mouser; Published: 2008-06-26; RoHS: Y; Value1: 5%; MountType: SMT; Supplier 1: Digi-Key; PackageReference: 0603; Tolerance_%: 5%; Res_ohm: 0; CompType: Resistor; LatestRevisionDate: 2017-03-09; PartNumber: MCT06030Z0000ZP500; ComponentLink1Description: Datasheet link; AEC Grade: N/A; Supplier Part Number 1: MCT0603-0.0-ZZCT-ND; Technology: Thin Film; ComponentLink1URL: http://www.vishay.com/docs/28705/mcx0x0xpro.pdf
R70 R71 = CMP-0026938-5: as R47 on sheet PROC054D_AWR_1_AWR_4_LP87524P; Supplier Part Number 2: 59M6733; Supplier 2: Newark; Supplier Part Number 3: 71-CRCW0402J-4.7K-E3; Supplier 3: Mouser; RoHS: E; Value1: 5%; MountType: SMT; Supplier 1: Digi-Key; PackageReference: 0402; Tolerance_%: 5%; Res_ohm: 4.7k; SizeArea_mm2: 0.5; CompType: Resistor; PartNumber: CRCW04024K70JNED; ComponentLink1Description: Datasheet link; Supplier Part Number 1: 541-4.7KJCT-ND; Technology: Thick Film; ComponentLink1URL: http://www.vishay.com/docs/20035/dcrcwe3.pdf
R74 R78 R80 R81 R95 = CMP-0025958-3: as R37 on sheet PROC054D_System_Power; Supplier Part Number 2: 52K6595; Supplier 2: Newark; Supplier Part Number 3: 71-CRCW0402-10K-E3; Supplier 3: Mouser; RoHS: E; Value1: 1%; MountType: SMT; Supplier 1: Digi-Key; PackageReference: 0402; Tolerance_%: 1%; SizeArea_mm2: 0.5; CompType: Resistor; PartNumber: CRCW040210K0FKED; ComponentLink1Description: Datasheet link; Supplier Part Number 1: 541-10.0KLCT-ND; Technology: Thick Film; ComponentLink1URL: http://www.vishay.com/docs/20035/dcrcwe3.pdf
TP21-TP24 TP26-TP28 TP31 = CMP-0003825-1: 1mm Test Point, SMT; Manufacturer: Any; CompType: Test Point; PackageReference: 1mm Test Point, SMT; Publisher: Texas Instruments; LatestRevisionDate: 2017-03-09; ComponentLink1Description: Datasheet Link; ComponentLink1URL: https://sps06.itg.ti.com/sites/KMS/crossdivteams/altium/docs/ComponentDatasheets/PROBE_TEST_POINT.png; Key: TP_SM_1MM; MountType: SMT; PartNumber: TP_SM_1MM
U4 = CMP-0083823-1: as U3 on sheet PROC054D_AWR_1_AWR_4_LP87524P; ComponentLink1URL: http://www.ti.com/lit/ds/symlink/lp87524-q1.pdf; PackageDescription: VQFN-HR-26; MountType: SMT; ComponentLink2URL: http://www.ti.com/product/lp87524-q1; ComponentLink3Description: Online Datasheet; ComponentLink2Description: Product Folder; Manufacturer: Texas Instruments; ComponentLink3URL: http://www.ti.com/product/lp87524-q1/datasheet; PackageReference: RNF0026C; PartNumber: LP87524PRNFTQ1; ComponentLink1Description: Datasheet Link